# EAGLE schematic E4_bolaNoPlano (EAGLE 8.0.2)
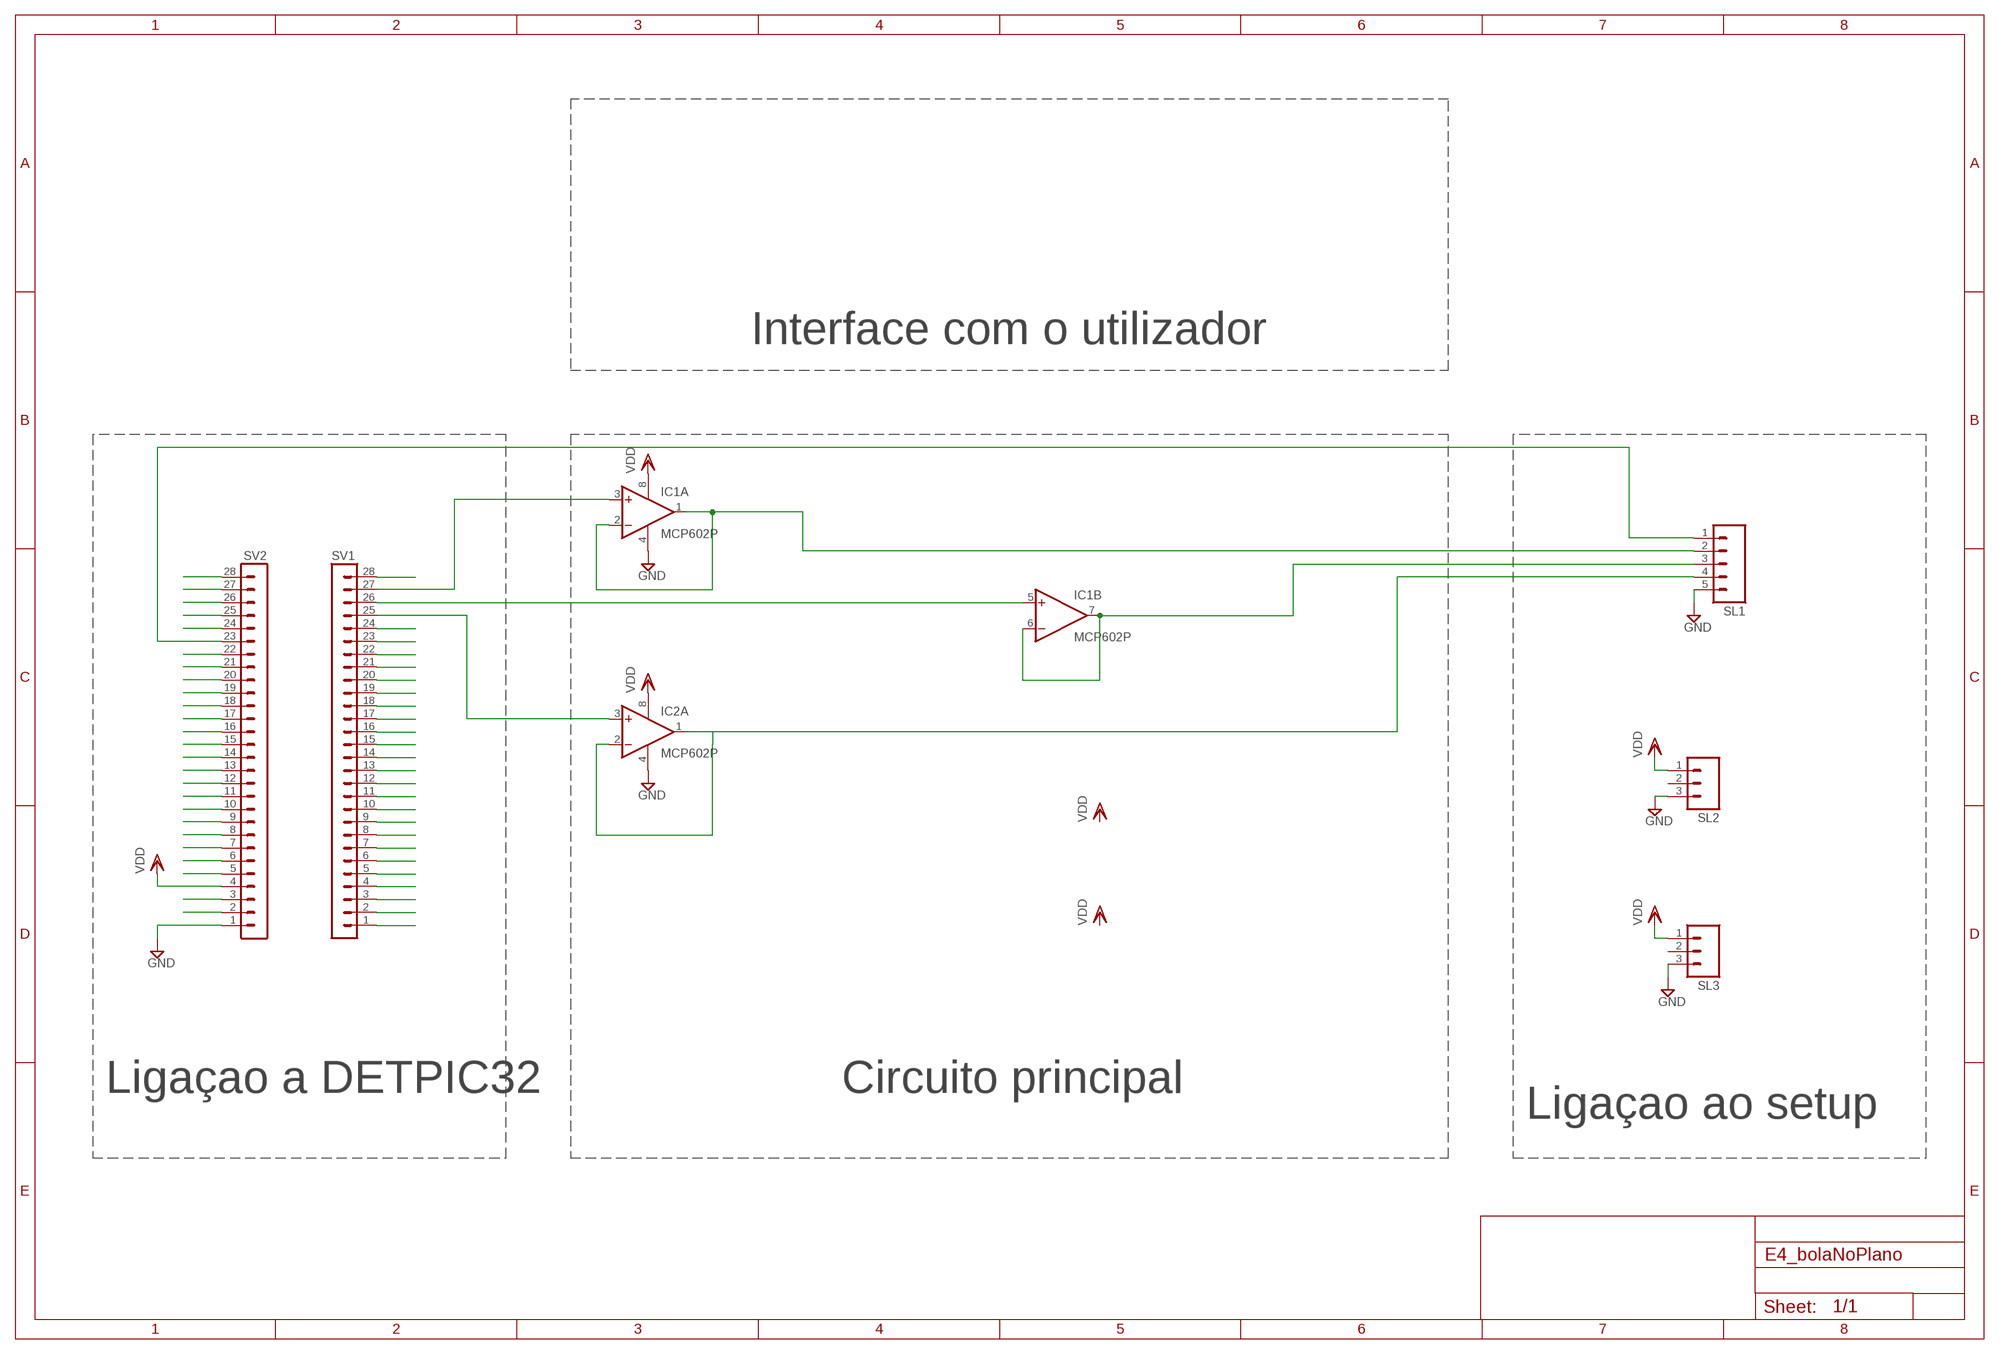
[diagram p0: schematic, sheet 1]

## Parts
IC1  MCP602P  [DIL08]
IC2  MCP602P  [DIL08]
SL1  MA05  [05PA]
SL2  MA03  [03P]
SL3  MA03  [03P]
SV1  MA28-1L  [MA28-1L]
SV2  MA28-1L  [MA28-1L]

## Nets
GND: IC1.4(P:V-) IC2.4(P:V-) SL1.5 SL2.3 SL3.3 SV2.1
N$1: SV1.1
N$2: SV1.2
N$3: SV1.3
N$4: SV1.4
N$5: SV1.5
N$6: SV1.6
N$7: SV1.7
N$8: SV1.8
N$9: SV1.10
N$10: SV1.11
N$11: SV1.12
N$12: SV1.13
N$13: SV1.14
N$14: SV1.15
N$15: SV1.16
N$16: SV1.17
N$17: SV1.18
N$18: SV1.19
N$19: SV1.20
N$20: SV1.21
N$21: SV1.22
N$22: SV1.23
N$23: SV1.24
N$24: IC2.3(A:+IN) SV1.25
N$25: IC1.5(B:+IN) SV1.26
N$26: IC1.3(A:+IN) SV1.27
N$28: SV2.2
N$29: SV1.28
N$30: SV2.3
N$32: SV2.5
N$33: SV2.6
N$34: SV2.7
N$35: SV2.8
N$36: SV2.9
N$37: SV2.10
N$38: SV2.11
N$39: SV2.12
N$40: SV2.13
N$41: SV2.14
N$42: SV2.15
N$43: SV2.16
N$44: SV2.17
N$45: SV2.18
N$46: SV2.19
N$47: SV2.20
N$48: SV2.21
N$49: SV2.22
N$51: SV2.24
N$52: SV2.25
N$53: SV2.26
N$54: SV2.27
N$55: SV2.28
N$56: IC2.1(A:OUT) IC2.2(A:-IN) SL1.4
N$57: IC1.1(A:OUT) IC1.2(A:-IN) SL1.2
N$58: IC1.6(B:-IN) IC1.7(B:OUT) SL1.3
N$61: SL1.1 SV2.23
NET: SV1.9
VDD: IC1.8(P:V+) IC2.8(P:V+) SL2.1 SL3.1 SV2.4
Unconnected: IC2.5(B:+IN) IC2.6(B:-IN) IC2.7(B:OUT) SL2.2 SL3.2

## Notes on the sheet
- Interface com o utilizador
- Ligaçao a DETPIC32 | Circuito principal
- Ligaçao ao setup

## Library data of the parts
IC1 IC2 = linear:MCP602: Single Op Amp 2.7V to 6.0V Single Supply CMOS Source: http://ww1.microchip.com/downloads/en/DeviceDoc/21314g.pdf
SL1 = con-amp-quick:MA05: AMP QUICK CONNECTOR; OC_FARNELL: unknown; OC_NEWARK: unknown
SL2 SL3 = con-amp-quick:MA03: AMP QUICK CONNECTOR; OC_FARNELL: unknown; OC_NEWARK: unknown
SV1 SV2 = e4:MA28-1L: PIN HEADER; OC_FARNELL: unknown; OC_NEWARK: unknown